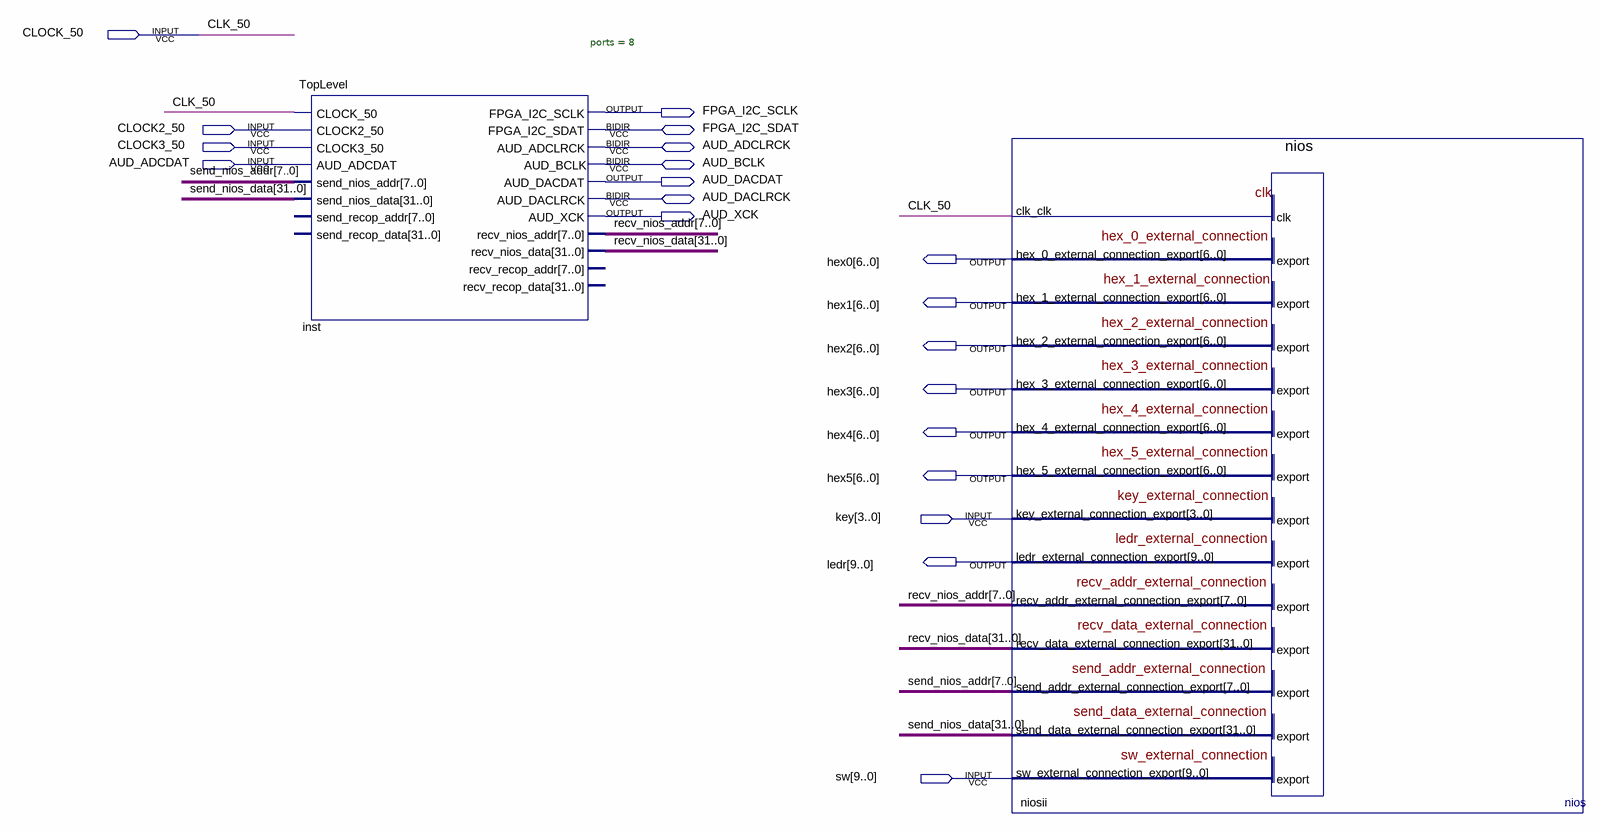
[diagram p0: schematic sheet]
// Quartus schematic toptoplevel.bdf as structural Verilog: 2 symbols, 20 pins
module toptoplevel (
  input  CLOCK_50,
  input  CLOCK2_50,
  input  CLOCK3_50,
  input  AUD_ADCDAT,
  input  [3:0] key,
  input  [9:0] sw,
  inout  FPGA_I2C_SDAT,
  inout  AUD_ADCLRCK,
  inout  AUD_BCLK,
  inout  AUD_DACLRCK,
  output FPGA_I2C_SCLK,
  output AUD_DACDAT,
  output AUD_XCK,
  output [6:0] hex0,
  output [6:0] hex1,
  output [6:0] hex2,
  output [6:0] hex3,
  output [6:0] hex4,
  output [6:0] hex5,
  output [9:0] ledr
);

  wire [7:0] recv_nios_addr, send_nios_addr;
  wire [31:0] recv_nios_data, send_nios_data;

  TopLevel #(.ports(8)) inst (
    .CLOCK_50(CLOCK_50), .CLOCK2_50(CLOCK2_50), .CLOCK3_50(CLOCK3_50), .AUD_ADCDAT(AUD_ADCDAT),
    .send_nios_addr(send_nios_addr), .send_nios_data(send_nios_data), .FPGA_I2C_SCLK(FPGA_I2C_SCLK),
    .AUD_DACDAT(AUD_DACDAT), .AUD_XCK(AUD_XCK), .recv_nios_addr(recv_nios_addr),
    .recv_nios_data(recv_nios_data), .FPGA_I2C_SDAT(FPGA_I2C_SDAT), .AUD_ADCLRCK(AUD_ADCLRCK),
    .AUD_BCLK(AUD_BCLK), .AUD_DACLRCK(AUD_DACLRCK));  // open: send_recop_addr, send_recop_data, recv_recop_addr, recv_recop_data
  nios niosii (
    .clk_clk(CLOCK_50), .key_external_connection_export(key),
    .recv_addr_external_connection_export(recv_nios_addr),
    .recv_data_external_connection_export(recv_nios_data), .sw_external_connection_export(sw),
    .hex_0_external_connection_export(hex0), .hex_1_external_connection_export(hex1),
    .hex_2_external_connection_export(hex2), .hex_3_external_connection_export(hex3),
    .hex_4_external_connection_export(hex4), .hex_5_external_connection_export(hex5),
    .ledr_external_connection_export(ledr), .send_addr_external_connection_export(send_nios_addr),
    .send_data_external_connection_export(send_nios_data));

  // Other names for the same wires on the sheet: CLK_50 = CLOCK_50
endmodule
